# EAGLE design XBee Explorer USB (EAGLE 6.4)
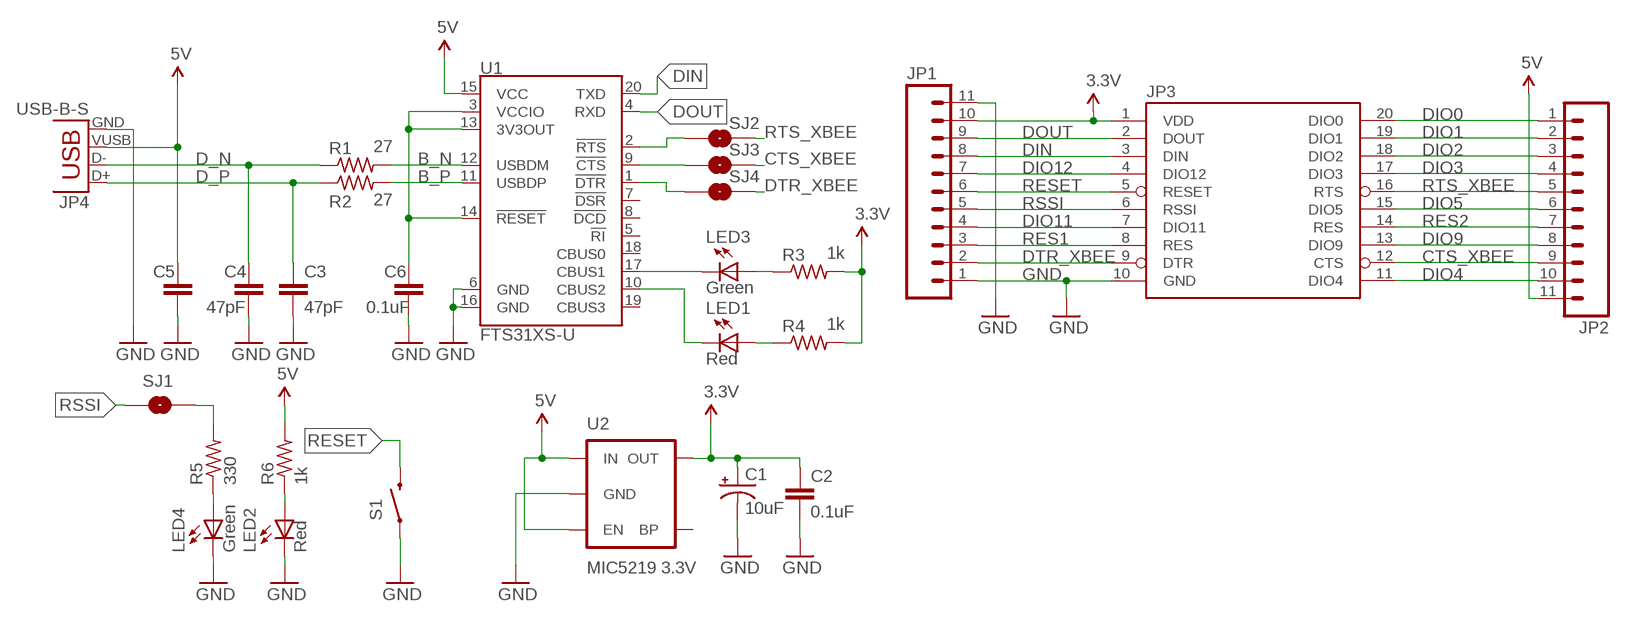
[diagram p0: schematic, sheet 1]

## Parts
C1  10uF  10UF-16V-10%(TANT)  [EIA3216]
C2  0.1uF  CAP0805  [0805]
C3  47pF  CAP0805  [0805]
C4  47pF  CAP0805  [0805]
C5  CAP0805  [0805]
C6  0.1uF  CAP0805  [0805]
JP1  M111X11_NO_SILK  [1X11_NO_SILK]
JP2  M111X11_NO_SILK  [1X11_NO_SILK]
JP3  XBEE-1B3  [XBEE-SMD]
JP4  USB-B-S  [USB-B-SMT]
LED1  Red  LEDCHIP-LED0805  [CHIP-LED0805]
LED2  Red  LEDCHIP-LED0805  [CHIP-LED0805]
LED3  Green  LEDCHIP-LED0805  [CHIP-LED0805]
LED4  Green  LEDCHIP-LED0805  [CHIP-LED0805]
R1  27  R-US_R0805  [R0805]
R2  27  R-US_R0805  [R0805]
R3  1k  R-US_R0805  [R0805]
R4  1k  R-US_R0805  [R0805]
R5  330  R-US_R0805  [R0805]
R6  1k  R-US_R0805  [R0805]
S1  SWITCH-MOMENTARY-2SMD  [TACTILE-SWITCH-SMD]
SJ1  SOLDERJUMPERTRACE  [SJ_2S-TRACE]
SJ2  SOLDERJUMPERTRACE  [SJ_2S-TRACE]
SJ3  SOLDERJUMPERTRACE  [SJ_2S-TRACE]
SJ4  SOLDERJUMPERTRACE  [SJ_2S-TRACE]
U1  FTS31XS-U  FT231XS  [SSOP20_L]
U2  MIC5219 3.3V  V_REG_MIC52193.3V  [SOT23-5]

## Nets
3.3V: C1.A(+) C2.1 JP1.10 JP3.1(VDD) R3.2 R4.2 U2.5(OUT)
5V: C5.1 JP2.11 JP4.VUSB(VBUS) R6.2 U1.15(VCC) U2.1(IN) U2.3(EN)
B_N [B]: R1.2 U1.12(USBDM)
B_P [B]: R2.2 U1.11(USBDP)
CTS_XBEE: JP2.9 JP3.12(CTS) SJ3.2
D_N [D]: C4.1 JP4.D- R1.1
D_P [D]: C3.1 JP4.D+ R2.1
DIN: JP1.8 JP3.3(DIN) U1.20(TXD)
DIO0: JP2.1 JP3.20(DIO0)
DIO1: JP2.2 JP3.19(DIO1)
DIO2: JP2.3 JP3.18(DIO2)
DIO3: JP2.4 JP3.17(DIO3)
DIO4: JP2.10 JP3.11(DIO4)
DIO5: JP2.6 JP3.15(DIO5)
DIO9: JP2.8 JP3.13(DIO9)
DIO11: JP1.4 JP3.7(DIO11)
DIO12: JP1.7 JP3.4(DIO12)
DOUT: JP1.9 JP3.2(DOUT) U1.4(RXD)
DTR_XBEE: JP1.2 JP3.9(DTR) SJ4.2
GND: C1.C(-) C2.2 C3.2 C4.2 C5.2 C6.2 JP1.1 JP1.11 JP3.10(GND) JP4.GND LED2.C LED4.C S1.1 U1.6(GND) U1.16(GND) U2.2(GND)
N$1: SJ2.1 U1.2(!RTS)
N$2: SJ3.1 U1.9(!CTS)
N$5: SJ4.1 U1.1(!DTR)
N$6: R5.2 SJ1.2
N$7: LED2.A R6.1
N$9: LED4.A R5.1
N$10: LED3.C U1.17(CBUS1)
N$11: LED1.C U1.10(CBUS2)
N$12: LED3.A R3.1
N$13: LED1.A R4.1
N$14: C6.1 U1.3(VCCIO) U1.13(3V3OUT) U1.14(!RESET)
RES1: JP1.3 JP3.8(RES)
RES2: JP2.7 JP3.14(RES)
RESET: JP1.6 JP3.5(RESET) S1.3
RSSI: JP1.5 JP3.6(RSSI) SJ1.1
RTS_XBEE: JP2.5 JP3.16(RTS) SJ2.2
Unconnected: U1.5(!RI) U1.7(!DSR) U1.8(!DCD) U1.18(CBUS0) U1.19(CBUS3) U2.4(BP)

## Library data of the parts
C1 = SparkFun-Capacitors:10UF-16V-10%(TANT): CAP-00811 1206/EIA-3216 Tantalum capacitor; PROD_ID: CAP-00811
C2-C6 = SparkFun-Capacitors:CAP: Capacitor Standard 0603 ceramic capacitor, and 0.1" leaded capacitor.
JP1 JP2 = SparkFun-Connectors:M11: Header 11 Standard 11-pin 0.1" header. Use with straight break away headers (SKU : PRT-00116), right angle break away headers (PRT-00553), swiss pins (PRT-00743), machine pins (PRT-00117), and female headers (PRT-00115).
JP3 = SparkFun-RF:XBEE-1: Xbee module footprints; PROD_ID: CONN-09042
JP4 = SparkFun-Connectors:USB: USB Connectors USB-B-PTH is fully proven SKU : PRT-00139/CONN-08278 USB-miniB is fully proven SKU : PRT-00587 USB-A-PCB is untested. USB-A-H is throughly reviewed, but untested. Spark Fun Electronics SKU : PRT-00437 USB-B-SMT is throughly reviewed, but untested. Needs silkscreen touching up. USB-A-S has not been used/tested USB-MB-H has not been used/tested USB-MICROB has been used. CONN-09505
LED1-LED4 = led:LED: LED OSRAM: - CHIPLED LG R971, LG N971, LY N971, LG Q971, LY Q971, LO R971, LY R971 LH N974, LH R974 LS Q976, LO Q976, LY Q976 LO Q996 - Hyper CHIPLED LW Q18S LB Q993, LB Q99A, LB R99A - SideLED LS A670, LO A670, LY A670, LG A670, LP A670 LB A673, LV A673, LT A673, LW A673 LH A674 LY A675 LS A676, LA A676, LO A676, LY A676, LW A676 LS A679, LY A679, LG A679 - Hyper Micro SIDELED® LS Y876, LA Y876, LO Y876, LY Y876 LT Y87S - SmartLED LW L88C, LW L88S LB L89C, LB L89S, LG L890 LS L89K, LO L89K, LY L89K LS L896, LA L896, LO L896, LY L896 - TOPLED LS T670, LO T670, LY T670, LG T670, LP T670 LSG T670, LSP T670, LSY T670, LOP T670, LYG T670 LG T671, LOG T671, LSG T671 LB T673, LV T673, LT T673, LW T673 LH T674 LS T676, LA T676, LO T676, LY T676, LB T676, LH T676, LSB T676, LW T676 LB T67C, LV T67C, LT T67C, LS T67K, LO T67K, LY T67K, LW E67C LS E67B, LA E67B, LO E67B, LY E67B, LB E67C, LV E67C, LT E67C LW T67C LS T679, LY T679, LG T679 LS T770, LO T770, LY T770, LG T770, LP T770 LB T773, LV T773, LT T773, LW T773 LH T774 LS E675, LA E675, LY E675, LS T675 LS T776, LA T776, LO T776, LY T776, LB T776 LHGB T686 LT T68C, LB T68C - Hyper Mini TOPLED® LB M676 - Mini TOPLED Santana® LG M470 LS M47K, LO M47K, LY M47K Source: http://www.osram.convergy.de LUXEON: - LUMILED® LXK2-PW12-R00, LXK2-PW12-S00, LXK2-PW14-U00, LXK2-PW14-V00 LXK2-PM12-R00, LXK2-PM12-S00, LXK2-PM14-U00 LXK2-PE12-Q00, LXK2-PE12-R00, LXK2-PE12-S00, LXK2-PE14-T00, LXK2-PE14-U00 LXK2-PB12-K00, LXK2-PB12-L00, LXK2-PB12-M00, LXK2-PB14-N00, LXK2-PB14-P00, LXK2-PB14-Q00 LXK2-PR12-L00, LXK2-PR12-M00, LXK2-PR14-Q00, LXK2-PR14-R00 LXK2-PD12-Q00, LXK2-PD12-R00, LXK2-PD12-S00 LXK2-PH12-R00, LXK2-PH12-S00 LXK2-PL12-P00, LXK2-PL12-Q00, LXK2-PL12-R00 Source: www.luxeon.com KINGBRIGHT: KA-3528ASYC Source: www.kingbright.com
R1-R6 = rcl:R-US_: RESISTOR, American symbol
S1 = SparkFun-Electromechanical:SWITCH-MOMENTARY-2: Various NO switches- pushbuttons, reed, etc; PROD_ID: SWCH-08247
SJ1-SJ4 = SparkFun-Retired:SOLDERJUMPER: Solder Jumper Standard SMD solder jumper. Used to automate production. Two varients : Normally Open and Normally Closed are the same, but have different paste layers. NC will have a large amount of paste and should jumper during reflow.
U1 = SparkFun-DigitalIC:FT231X: FTDI FT231X Full Speed USB to Full-handshake UART This USB2.0 Full Speed IC offers a compact bridge to full handshake UART interfaces. The device is a UART, capable of operating up to 3MBaud, with low power consumption (8mA). The FT231X includes the complete FT-X series feature set and enables USB to be added into a system design quickly and easily over a UART interface.; PROD_ID: IC-11524
U2 = SparkFun-PowerIC:V_REG_MIC5219: V_REG MIC5219 Standard 3.3V and 5V 500mA LDO voltage regulator in SOT-23 layout. Micrel part MIC5219. BP (by-pass) pin is used to lower output noise with 470pF cap, may be left open.; PROD_ID: VREG-09872

## Net classes
0 default: width 0.254 mm, drill 0.508 mm, clearance 0.203 mm
1 D: width 0.191 mm, drill 0.508 mm, clearance 0.191 mm
2 +5V: width 0.254 mm, drill 0.508 mm, clearance 0.203 mm
3 B: width 0.191 mm, drill 0.508 mm, clearance 0.191 mm

## Board
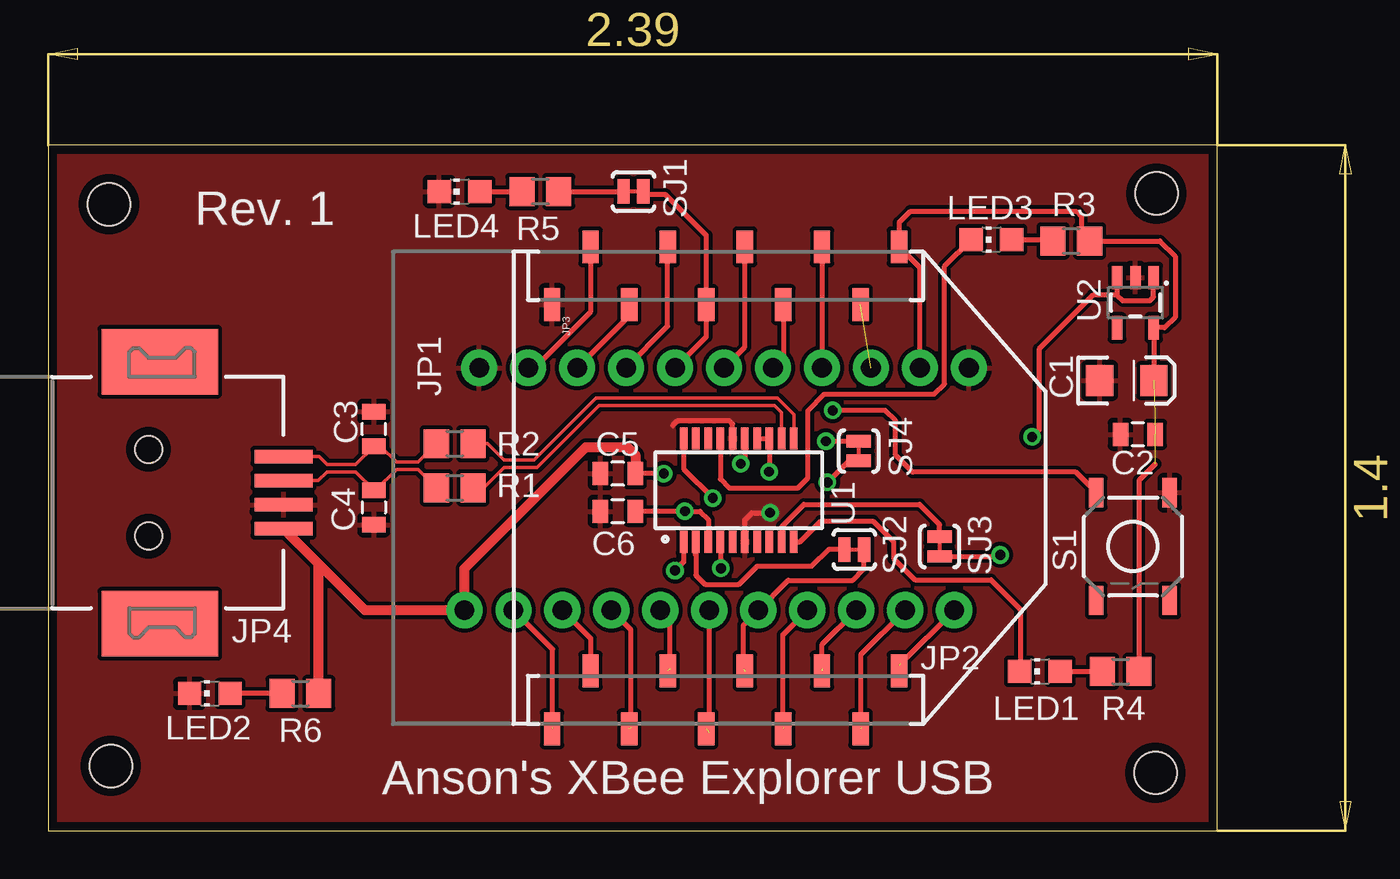
[diagram p1: board, top side]
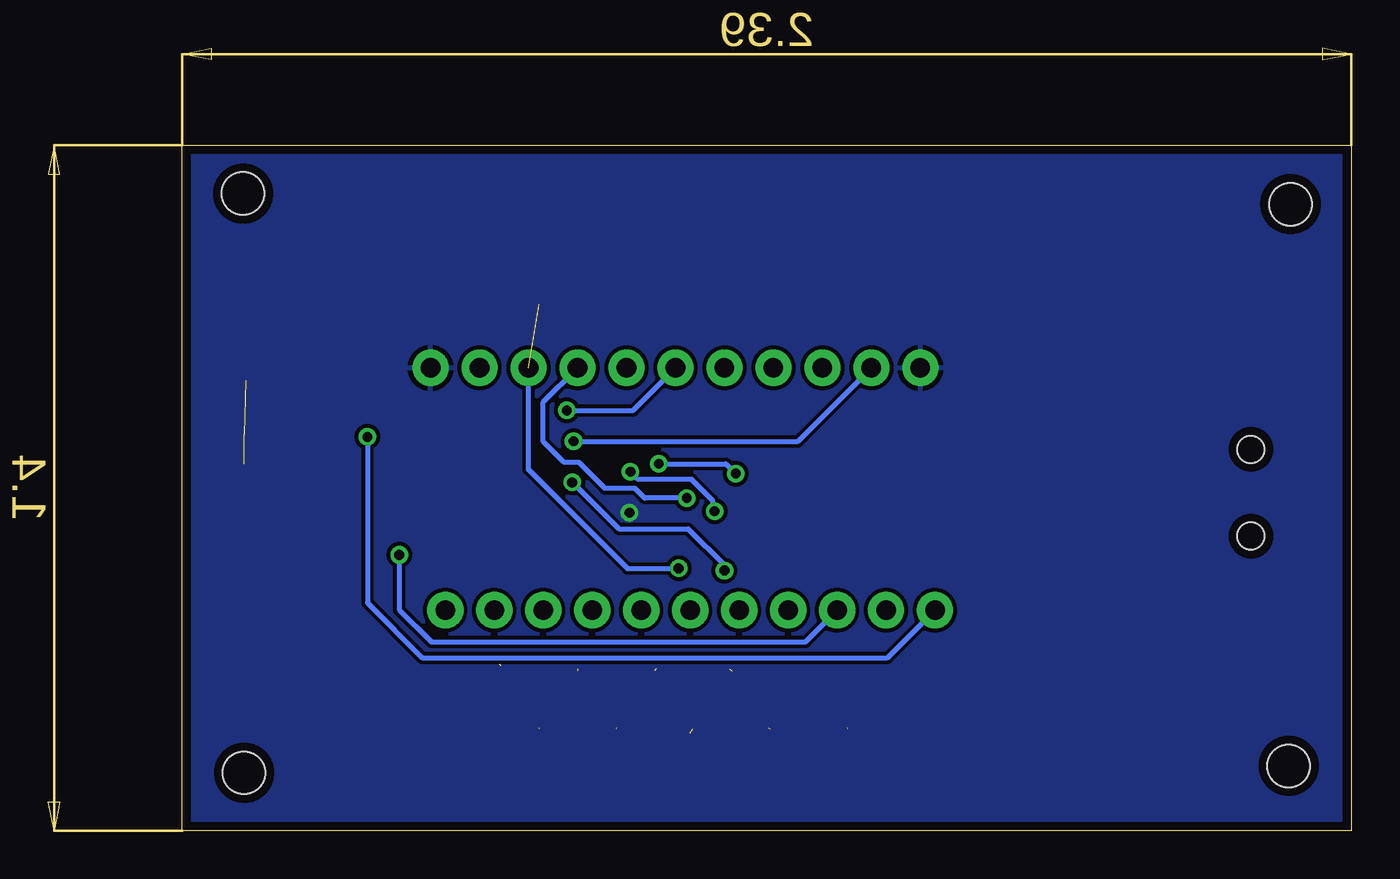
[diagram p2: board, bottom side, seen from below]

Size 60.63 x 35.55 mm. Coordinates in mm from the lower left corner, seen from the top.
Outline: 0,0 60.63,0 60.63,35.55 0,35.55 0,0
Copper layers (1*16): Top 0.035mm / dielectric 1.5mm / Bottom 0.035mm
Design rules "default *": minimum track width 6mil, minimum drill 13mil, track to track 6mil, track to pad 6mil, pad to pad 6mil, via to via 6mil, smd to smd 6mil, copper to edge 18mil, drill to drill 8mil, minimum pad ring 10mil, minimum via ring 8mil, stop-mask expansion 5mil, vias tented up to drill 0mil, thermal gap 10mil
Holes 2.2 mm at 3.15,32.49 3.25,3.35 57.43,3 57.48,33.05

### Footprints (pad centres in the part's own frame; a part is rotated, then mirrored left to right if it is on the bottom)
EIA3216 = smd 1.4 x 1.6: A 1.4,0; C -1.4,0
0805 = smd 0.8 x 1.2: 1 -0.9,0; 2 0.9,0
1X11_NO_SILK = drill 1.016 pad 1.88: 1 0,0; 2 2.54,0; 3 5.08,0; 4 7.62,0; 5 10.16,0; 6 12.7,0; 7 15.24,0; 8 17.78,0; 9 20.32,0; 10 22.86,0; 11 25.4,0
XBEE-SMD = smd 1.7 x 0.85: 1 -12.5,20; 2 -9.5,18; 3 -12.5,16; 4 -9.5,14; 5 -12.5,12; 6 -9.5,10; 7 -12.5,8; 8 -9.5,6; 9 -12.5,4; 10 -9.5,2; 11 12.5,2; 12 9.5,4; 13 12.5,6; 14 9.5,8; 15 12.5,10; 16 9.5,12; 17 12.5,14; 18 9.5,16; 19 12.5,18; 20 9.5,20
USB-B-SMT = smd 6.04 x 3.4: 5 0.58,6.8; 6 0.58,-6.8 | smd 3 x 0.7: D+ 7,1.875; D- 7,0.625; GND 7,-0.625; VUSB 7,-1.875 | hole 1.4: 0,2.25; 0,-2.25
CHIP-LED0805 = smd 1.2 x 1.2: A 0,-1.05; C 0,1.05
R0805 = smd 1.3 x 1.5: 1 -0.95,0; 2 0.95,0
TACTILE-SWITCH-SMD = smd 1.524 x 0.762: 1 -2.794,1.905; 2 2.794,1.905; 3 -2.794,-1.905; 4 2.794,-1.905
SJ_2S-TRACE = smd 0.635 x 1.27: 1 -0.508,0; 2 0.508,0
SSOP20_L = smd 0.381 x 1.143: 1 -2.857,-2.68; 2 -2.223,-2.68; 3 -1.587,-2.68; 4 -0.953,-2.68; 5 -0.318,-2.68; 6 0.318,-2.68; 7 0.953,-2.68; 8 1.587,-2.68; 9 2.223,-2.68; 10 2.857,-2.68; 11 2.857,2.68; 12 2.223,2.68; 13 1.587,2.68; 14 0.953,2.68; 15 0.318,2.68; 16 -0.318,2.68; 17 -0.953,2.68; 18 -1.587,2.68; 19 -2.223,2.68; 20 -2.857,2.68
SOT23-5 = smd 0.55 x 1.2: 1 -0.95,-1.3; 2 0,-1.3; 3 0.95,-1.3; 4 0.95,1.3; 5 -0.95,1.3

### Placement (x,y rotation side)
C1  55.93,23.34 0 top
C2  56.52,20.55 180 top
C3  16.89,20.83 90 top
C4  16.89,16.76 270 top
C5  29.54,18.52 180 top
C6  29.54,16.56 180 top
JP1  22.35,24 0 top
JP2  46.99,11.43 180 top
JP3  24.13,17.78 270 top
JP4  5.21,17.53 0 top
LED1  51.44,8.26 90 top
LED2  8.38,7.11 90 top
LED3  48.92,30.66 90 top
LED4  21.34,33.15 90 top
R1  21.08,17.78 0 top
R2  21.08,20.07 0 top
R3  53.06,30.58 0 top
R4  55.63,8.26 0 top
R5  25.53,33.15 0 top
R6  13.08,7.11 0 top
S1  56.26,14.73 270 top
SJ1  30.35,33.15 180 top
SJ2  41.81,14.58 0 top
SJ3  46.23,14.73 270 top
SJ4  42.04,19.68 90 top
U1  35.81,17.65 0 top
U2  56.39,27.38 180 top

### Tracks (layer width: path | path; a pad name or v marks a point on that pad's centre or on a via)
3.3V  (2 unrouted)
  Top 0.254: JP1.10 45.21,29.2 JP3.1 44.13,31.53 44.73,32.13 53.31,32.13 53.59,31.85 53.59,31 R3.2 57.66,30.58 58.45,29.79 58.45,26.62 57.91,26.08 U2.5 C1.A | 57.41,19.01 56.57,18.16 56.57,8.27 R4.2
5V  (via drill 0.51)
  Top 0.254: U2.3 55.44,27.77 | 55.44,27.77 55.73,27.48 57.12,27.48 57.33,27.69 57.33,28.67 U2.1 | 55.44,27.77 54.19,27.77 51.38,24.97 51.38,20.78 v51.03,20.42 | v31.93,18.52 C5.1 | U1.15 36.13,19.24 v35.92,19.02
  Top 0.508: R6.2 14.03,13.83 | 14.03,13.83 JP4.VUSB | 14.03,13.83 16.43,11.43 JP2.11 21.59,13.59 27.89,19.89 30.05,19.89 30.45,19.48 30.45,18.53 C5.1
  Bottom 0.254: v51.03,20.42 51.03,11.81 48.18,8.97 24.05,8.97 JP2.11 | v35.92,19.02 32.44,19.02 v31.93,18.52
B_N
  Top 0.191: R1.2 22.59,17.78 23.65,18.83 25.35,18.83 28.58,22.06 37.66,22.06 38.04,21.68 U1.12
B_P
  Top 0.191: R2.2 22.8,20.07 23.65,19.21 25.19,19.21 28.42,22.44 37.82,22.44 38.67,21.59 U1.11
CTS_XBEE  (via drill 0.51)
  Top 0.254: JP2.9 28.13,9.97 JP3.12 | SJ3.2 49.3,14.22 v49.38,14.3
  Bottom 0.254: v49.38,14.3 49.38,11.46 47.7,9.78 28.32,9.78 JP2.9
D_N
  Top 0.191: JP4.D- 14,18.15 14.46,18.61 15.95,18.61 C4.1 16.99,17.66 18.06,18.73 19.18,18.73 R1.1
D_P
  Top 0.191: JP4.D+ 14.04,19.4 14.46,18.99 15.95,18.99 C3.1 17.25,19.93 18.06,19.11 19.18,19.11 R2.1
DIN  (via drill 0.51)
  Top 0.254: JP3.3 JP1.8 | U1.20 32.96,18.76 v34.47,17.25
  Bottom 0.254: JP1.8 41.91,22.23 41.91,20.19 40.82,19.1 40.06,19.1 38.71,17.75 37.16,17.75 36.65,17.25 v34.47,17.25
DIO0  (1 unrouted)
  Top 0.254: 44.2,8.38 44.2,8.64 JP2.1
  Top 0.406: JP3.20 44.13,8.57
DIO1  (1 unrouted)
  Top 0.254: 42.16,5.33 42.16,9.14 JP2.2
DIO2  (1 unrouted)
  Top 0.254: 40.13,8.38 40.13,9.65 JP2.3
DIO3  (1 unrouted)
  Top 0.254: 38.1,5.33 38.1,10.16 JP2.4
DIO4  (1 unrouted)
  Top 0.254: 26.16,5.33 26.16,9.4 JP2.10
DIO5  (1 unrouted)
  Top 0.254: 34.29,5.08 JP2.6
DIO9  (1 unrouted)
  Top 0.254: 30.23,5.33 30.23,10.41 JP2.8
DIO11
  Top 0.254: JP1.4 32.13,26.16 JP3.7
DIO12
  Top 0.254: JP3.4 38.13,24.54 JP1.7
DOUT  (via drill 0.51)  (1 unrouted)
  Top 0.254: U1.4 34.86,13.63 v34.89,13.6
  Bottom 0.254: JP1.9 42.67,18.72 37.54,13.59 v34.9,13.59 v34.89,13.6
DTR_XBEE  (via drill 0.51)
  Top 0.254: JP1.2 25.22,24 28.14,26.92 28.14,30.27 JP3.9 | SJ4.2 v40.34,20.19
  Bottom 0.254: JP1.2 28.47,20.42 28.7,20.19 v40.34,20.19
GND  (via drill 0.51)
  Top 0.254: U1.6 36.13,16.12 36.5,16.48 v37.44,16.48 | U1.16 35.5,21.09 35.36,21.23 32.61,21.23 32.38,21.01
  Bottom 0.254: v37.44,16.48 37.64,16.48
  pour Top: -1.27,36.83 -1.27,-1.27 62.23,-1.27 62.23,36.83
  pour Bottom: -2.54,38.1 -2.54,-2.54 10.16,-2.54 63.5,-2.54 63.5,38.1
N$1
  Top 0.254: SJ2.1 40.46,14.58 39.6,13.72 36.78,13.72 35.84,12.78 34.06,12.78 33.59,13.25 U1.2 33.58,14.28
N$2
  Top 0.254: SJ3.1 46.23,15.88 45.19,16.92 39.19,16.92 38.05,15.77 38.05,14.99 U1.9
N$5  (via drill 0.51)
  Top 0.254: SJ4.1 41.53,19.18 v40.41,18.06 | U1.1 32.96,13.93 v32.51,13.49
  Bottom 0.254: v40.41,18.06 40.39,18.06 37.97,15.65 34.39,15.65 32.51,13.77 v32.51,13.49
N$6
  Top 0.254: R5.2 SJ1.2
N$7
  Top 0.254: R6.1 LED2.A
N$9
  Top 0.254: LED4.A R5.1
N$10
  Top 0.254: 34.87,20.55 34.86,20.54 U1.17 34.86,18.22 35.31,17.78 38.89,17.78 39.4,18.29 39.4,21.77 40.26,22.63 45.95,22.63 46.48,23.16 46.48,29.27 LED3.C
N$11
  Top 0.254: U1.10 39,14.97 40.08,16.05 42.77,16.05 43.84,14.99 43.84,14.12 44.96,13.01 48.9,13.01 50.42,11.48 50.42,8.29 LED1.C
N$12
  Top 0.254: LED3.A 52.03,30.66 R3.1
N$13
  Top 0.254: LED1.A R4.1
N$14  (via drill 0.51)
  Top 0.254: U1.3 34.24,14.99 34.24,16.13 33.81,16.56 v33.02,16.56 C6.1 | v37.39,18.62 37.4,18.63 U1.13 U1.14
  Bottom 0.254: v33.02,16.56 33.12,16.66 33.12,17.12 34.21,18.21 36.98,18.21 v37.39,18.62
RES1
  Top 0.254: JP1.3 30.13,26.7 JP3.8
RES2  (1 unrouted)
  Top 0.254: 32.26,8.38 32.26,10.92 JP2.7
RESET  (via drill 0.51)
  Top 0.254: JP1.6 36.13,25.08 JP3.5 | S1.3 53.29,18.59 44.83,18.59 43.94,19.48 43.94,21.26 43.41,21.79 v40.69,21.79
  Bottom 0.254: v40.69,21.79 37.26,21.79 JP1.6
RSSI
  Top 0.254: JP1.5 34.13,25.62 JP3.6 34.13,30.87 32,32.99 31.01,32.99 SJ1.1
RTS_XBEE  (1 unrouted)
  Top 0.254: 36.07,8.38 36.07,10.67 JP2.5 38.38,12.98 41.73,12.98 42.32,13.56 SJ2.2

### Text on the board
tNames: Rev. 1 | Anson's XBee Explorer USB